# Altium schematic sheet Spare_Pins.SchDoc
size Letter; SheetNumber: 5; SheetTotal: 5
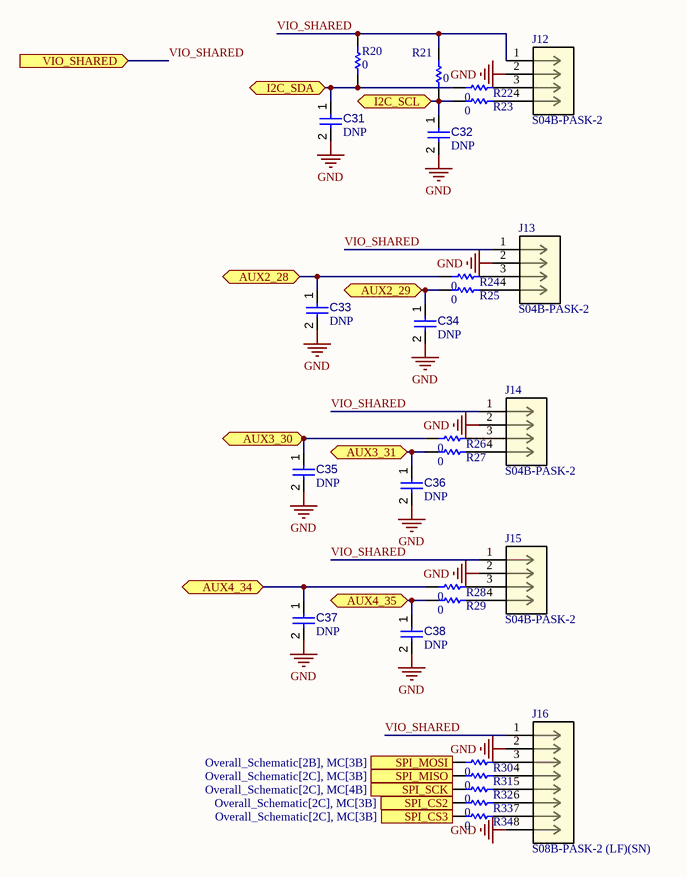
[diagram p0: Spare_Pins.SchDoc]

## Parts
C31  value DNP  [CAPC1608X90X40ML10T20]  (hidden comment: DNP/placeholder)
C32  value DNP  [CAPC1608X90X40ML10T20]  (hidden comment: DNP/placeholder)
C33  value DNP  [CAPC1608X90X40ML10T20]  (hidden comment: DNP/placeholder)
C34  value DNP  [CAPC1608X90X40ML10T20]  (hidden comment: DNP/placeholder)
C35  value DNP  [CAPC1608X90X40ML10T20]  (hidden comment: DNP/placeholder)
C36  value DNP  [CAPC1608X90X40ML10T20]  (hidden comment: DNP/placeholder)
C37  value DNP  [CAPC1608X90X40ML10T20]  (hidden comment: DNP/placeholder)
C38  value DNP  [CAPC1608X90X40ML10T20]  (hidden comment: DNP/placeholder)
J12  S04B-PASK-2  [CONN4_S04B-PASK_JST]
J13  S04B-PASK-2  [CONN4_S04B-PASK_JST]
J14  S04B-PASK-2  [CONN4_S04B-PASK_JST]
J15  S04B-PASK-2  [CONN4_S04B-PASK_JST]
J16  S08B-PASK-2 (LF)(SN)  [CONN_S08B-PASK-2_JST]
R20  value 0  [RESC1608X55X25ML10T15]  (hidden comment: Resistor 0R +/- 5% 0603 100 mW)
R21  value 0  [RESC1608X55X25ML10T15]  (hidden comment: Resistor 0R +/- 5% 0603 100 mW)
R22  value 0  [RESC1608X55X25ML10T15]  (hidden comment: Resistor 0R +/- 5% 0603 100 mW)
R23  value 0  [RESC1608X55X25ML10T15]  (hidden comment: Resistor 0R +/- 5% 0603 100 mW)
R24  value 0  [RESC1608X55X25ML10T15]  (hidden comment: Resistor 0R +/- 5% 0603 100 mW)
R25  value 0  [RESC1608X55X25ML10T15]  (hidden comment: Resistor 0R +/- 5% 0603 100 mW)
R26  value 0  [RESC1608X55X25ML10T15]  (hidden comment: Resistor 0R +/- 5% 0603 100 mW)
R27  value 0  [RESC1608X55X25ML10T15]  (hidden comment: Resistor 0R +/- 5% 0603 100 mW)
R28  value 0  [RESC1608X55X25ML10T15]  (hidden comment: Resistor 0R +/- 5% 0603 100 mW)
R29  value 0  [RESC1608X55X25ML10T15]  (hidden comment: Resistor 0R +/- 5% 0603 100 mW)
R30  value 0  [RESC1608X55X25ML10T15]  (hidden comment: Resistor 0R +/- 5% 0603 100 mW)
R31  value 0  [RESC1608X55X25ML10T15]  (hidden comment: Resistor 0R +/- 5% 0603 100 mW)
R32  value 0  [RESC1608X55X25ML10T15]  (hidden comment: Resistor 0R +/- 5% 0603 100 mW)
R33  value 0  [RESC1608X55X25ML10T15]  (hidden comment: Resistor 0R +/- 5% 0603 100 mW)
R34  value 0  [RESC1608X55X25ML10T15]  (hidden comment: Resistor 0R +/- 5% 0603 100 mW)

## Ports
AUX2_28 (bidir, see Overall_Schematic[2B], MC[4B]), AUX2_29 (bidir, see Overall_Schematic[2B], MC[4B]), AUX3_30 (bidir, see Overall_Schematic[2B], MC[4B]), AUX3_31 (bidir, see Overall_Schematic[2B], MC[4B]), AUX4_34 (bidir, see Overall_Schematic[2B], MC[4B]), AUX4_35 (bidir, see Overall_Schematic[2B], MC[4B]), I2C_SCL (bidir, see Overall_Schematic[2B], MC[4B]), I2C_SDA (bidir, see Overall_Schematic[2B], MC[4B]), SPI_CS2 (in, see Overall_Schematic[2C], MC[3B]), SPI_CS3 (in, see Overall_Schematic[2C], MC[3B]), SPI_MISO (out, see Overall_Schematic[2C], MC[3B]), SPI_MOSI (in, see Overall_Schematic[2B], MC[3B]), SPI_SCK (in, see Overall_Schematic[2C], MC[4B]), VIO_SHARED (in, see Overall_Schematic[2C], MC[3C], Ｄｒｉｖｅｒｓ[1A])

## Nets
GND: C31.2 C32.2 C33.2 C34.2 C35.2 C36.2 C37.2 C38.2 J12.2 J13.2 J14.2 J15.2 J16.2 J16.8
AUX2_28: C33.1 R24.1 ; port AUX2_28
AUX2_29: C34.1 R25.1 ; port AUX2_29
AUX3_30: C35.1 R26.1 ; port AUX3_30
AUX3_31: C36.1 R27.1 ; port AUX3_31
AUX4_34: C37.1 R28.1 ; port AUX4_34
AUX4_35: C38.1 R29.1 ; port AUX4_35
I2C_SCL: C32.1 R21.1 R23.1 ; port I2C_SCL
I2C_SDA: C31.1 R20.1 R22.1 ; port I2C_SDA
SPI_CS2: R33.1 ; port SPI_CS2
SPI_CS3: R34.1 ; port SPI_CS3
SPI_MISO: R31.1 ; port SPI_MISO
SPI_MOSI: R30.1 ; port SPI_MOSI
SPI_SCK: R32.1 ; port SPI_SCK
VIO_SHARED: J12.1 J13.1 J14.1 J15.1 J16.1 R20.2 R21.2 ; port VIO_SHARED
NetJ12_3: J12.3 R22.2
NetJ12_4: J12.4 R23.2
NetJ13_3: J13.3 R24.2
NetJ13_4: J13.4 R25.2
NetJ14_3: J14.3 R26.2
NetJ14_4: J14.4 R27.2
NetJ15_3: J15.3 R28.2
NetJ15_4: J15.4 R29.2
NetJ16_3: J16.3 R30.2
NetJ16_4: J16.4 R31.2
NetJ16_5: J16.5 R32.2
NetJ16_6: J16.6 R33.2
NetJ16_7: J16.7 R34.2

## Library data of the parts
C31-C38 = CMP-001-00014-6: 0603 (1608 Metric); Capacitor Type: Ceramic; Tolerance: 5%; Voltage Rating: 50V; RoHS Compliant: True; Case/Package: 0603; Max Operating Temperature: 125°C; Pins: 2; Mounting Technology: SM; Min Operating Temperature: -55°C
J12-J15 = S04B-PASK-2: Description; Manufacturer_Name: JST; Type: Headers, Male Pins; Copyright: Copyright (C) 2025 Ultra Librarian. All rights reserved.; Manufacturer_Part_Number: S04B-PASK-2; RefDes: RefDes
J16 = S08B-PASK-2 LFSN: Description; Manufacturer_Name: JST; Copyright: Copyright (C) 2026 Ultra Librarian. All rights reserved.; Manufacturer_Part_Number: S08B-PASK-2 (LF)(SN); RefDes: RefDes; Type: Type
R20-R34 = CMP-009-00006-5: Chip Resistor, 0 Ohm, 0.1 W, -55 to 155 degC, 0603 (1608 Metric); Power: 100mW; Voltage Rating: 50V; Max Operating Temperature: 155°C; RoHS Compliant: True; Mounting Technology: SM; Case/Package: 0603; Min Operating Temperature: -55°C; Tolerance: 5%; Pins: 2